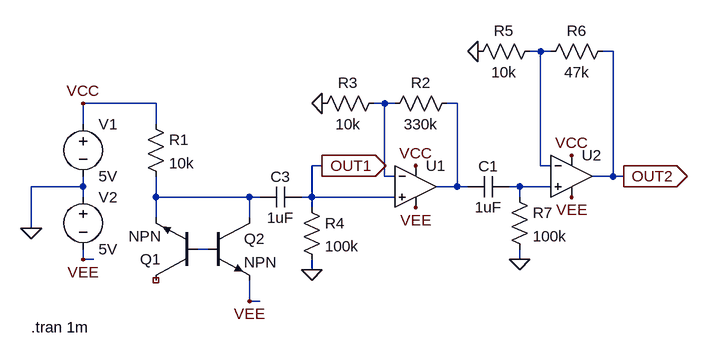
[diagram p0: schematic Noise Generator_Dick Cappels.asc]
Noise Generator_Dick Cappels.asc, the LTspice schematic file:
Version 4
SHEET 1 1076 680
WIRE 752 -144 736 -144
WIRE 768 -144 752 -144
WIRE 864 -144 848 -144
WIRE 160 -64 48 -64
WIRE 512 -64 496 -64
WIRE 528 -64 512 -64
WIRE 624 -64 608 -64
WIRE 48 -32 48 -64
WIRE 160 -32 160 -64
WIRE 416 32 400 32
WIRE 752 32 752 -144
WIRE 768 32 752 32
WIRE 512 48 512 -64
WIRE 528 48 512 48
WIRE 864 48 864 -144
WIRE 864 48 832 48
WIRE 880 48 864 48
WIRE 48 64 48 48
WIRE 48 64 -32 64
WIRE 624 64 624 -64
WIRE 624 64 592 64
WIRE 640 64 624 64
WIRE 720 64 704 64
WIRE 768 64 720 64
WIRE 48 80 48 64
WIRE 160 80 160 48
WIRE 304 80 160 80
WIRE 320 80 304 80
WIRE 400 80 400 32
WIRE 400 80 384 80
WIRE 528 80 400 80
WIRE 720 80 720 64
WIRE 400 96 400 80
WIRE 160 112 160 80
WIRE 304 112 304 80
WIRE -32 128 -32 64
WIRE 240 160 224 160
WIRE 48 176 48 160
WIRE 64 176 48 176
WIRE 720 176 720 160
WIRE 400 192 400 176
WIRE 304 240 304 208
WIRE 320 240 304 240
FLAG 416 32 OUT1
IOPIN 416 32 Out
FLAG -32 128 0
FLAG 400 192 0
FLAG 48 176 VEE
FLAG 304 240 VEE
FLAG 560 32 VCC
FLAG 560 96 VEE
FLAG 416 -64 0
FLAG 656 -144 0
FLAG 800 16 VCC
FLAG 800 80 VEE
FLAG 48 -64 VCC
FLAG 880 48 OUT2
IOPIN 880 48 Out
FLAG 720 176 0
SYMBOL npn 224 208 R180
SYMATTR InstName Q1
SYMBOL res 144 -48 R0
SYMATTR InstName R1
SYMATTR Value 10k
SYMBOL npn 240 112 R0
SYMATTR InstName Q2
SYMBOL voltage 48 -48 R0
WINDOW 123 0 0 Left 2
WINDOW 39 0 0 Left 2
SYMATTR InstName V1
SYMATTR Value 5V
SYMBOL cap 384 64 R90
WINDOW 0 0 32 VBottom 2
WINDOW 3 32 32 VTop 2
SYMATTR InstName C3
SYMATTR Value 1uF
SYMBOL res 384 80 R0
SYMATTR InstName R4
SYMATTR Value 100k
SYMBOL voltage 48 64 R0
WINDOW 123 0 0 Left 2
WINDOW 39 0 0 Left 2
SYMATTR InstName V2
SYMATTR Value 5V
SYMBOL Opamps\\UniversalOpamp2 560 64 R0
SYMATTR InstName U1
SYMBOL res 624 -80 R90
WINDOW 0 0 56 VBottom 2
WINDOW 3 32 56 VTop 2
SYMATTR InstName R2
SYMATTR Value 330k
SYMBOL res 512 -80 R90
WINDOW 0 0 56 VBottom 2
WINDOW 3 32 56 VTop 2
SYMATTR InstName R3
SYMATTR Value 10k
SYMBOL Opamps\\UniversalOpamp2 800 48 R0
SYMATTR InstName U2
SYMBOL res 752 -160 R90
WINDOW 0 0 56 VBottom 2
WINDOW 3 32 56 VTop 2
SYMATTR InstName R5
SYMATTR Value 10k
SYMBOL res 864 -160 R90
WINDOW 0 0 56 VBottom 2
WINDOW 3 32 56 VTop 2
SYMATTR InstName R6
SYMATTR Value 47k
SYMBOL cap 704 48 R90
WINDOW 0 0 32 VBottom 2
WINDOW 3 32 32 VTop 2
SYMATTR InstName C1
SYMATTR Value 1uF
SYMBOL res 704 64 R0
SYMATTR InstName R7
SYMATTR Value 100k
TEXT -32 280 Left 2 !.tran 1m

The netlist it stands for:
* Noise Generator_Dick Cappels.asc
Q1 NC_01 N006 N005 0 NPN
R1 VCC N005 10k
Q2 N005 N006 VEE 0 NPN
V1 VCC 0 5V
C3 OUT1 N005 1uF
R4 OUT1 0 100k
V2 0 VEE 5V
XU1 OUT1 N002 VCC VEE N003 level.2 Avol=1Meg GBW=10Meg Slew=10Meg ilimit=25m rail=0 Vos=0 phimargin=45 en=0 enk=0 in=0 ink=0 Rin=500Meg  ; pins IN+ IN- V+ V- OUT
R2 N003 N002 330k
R3 N002 0 10k
XU2 N004 N001 VCC VEE OUT2 level.2 Avol=1Meg GBW=10Meg Slew=10Meg ilimit=25m rail=0 Vos=0 phimargin=45 en=0 enk=0 in=0 ink=0 Rin=500Meg  ; pins IN+ IN- V+ V- OUT
R5 N001 0 10k
R6 OUT2 N001 47k
C1 N004 N003 1uF
R7 N004 0 100k
.model NPN NPN
.model PNP PNP
.lib standard.bjt
.tran 1m
.lib UniversalOpamps2.sub
.backanno
.end